# EAGLE schematic PROTOMODULE (EAGLE 6.1)
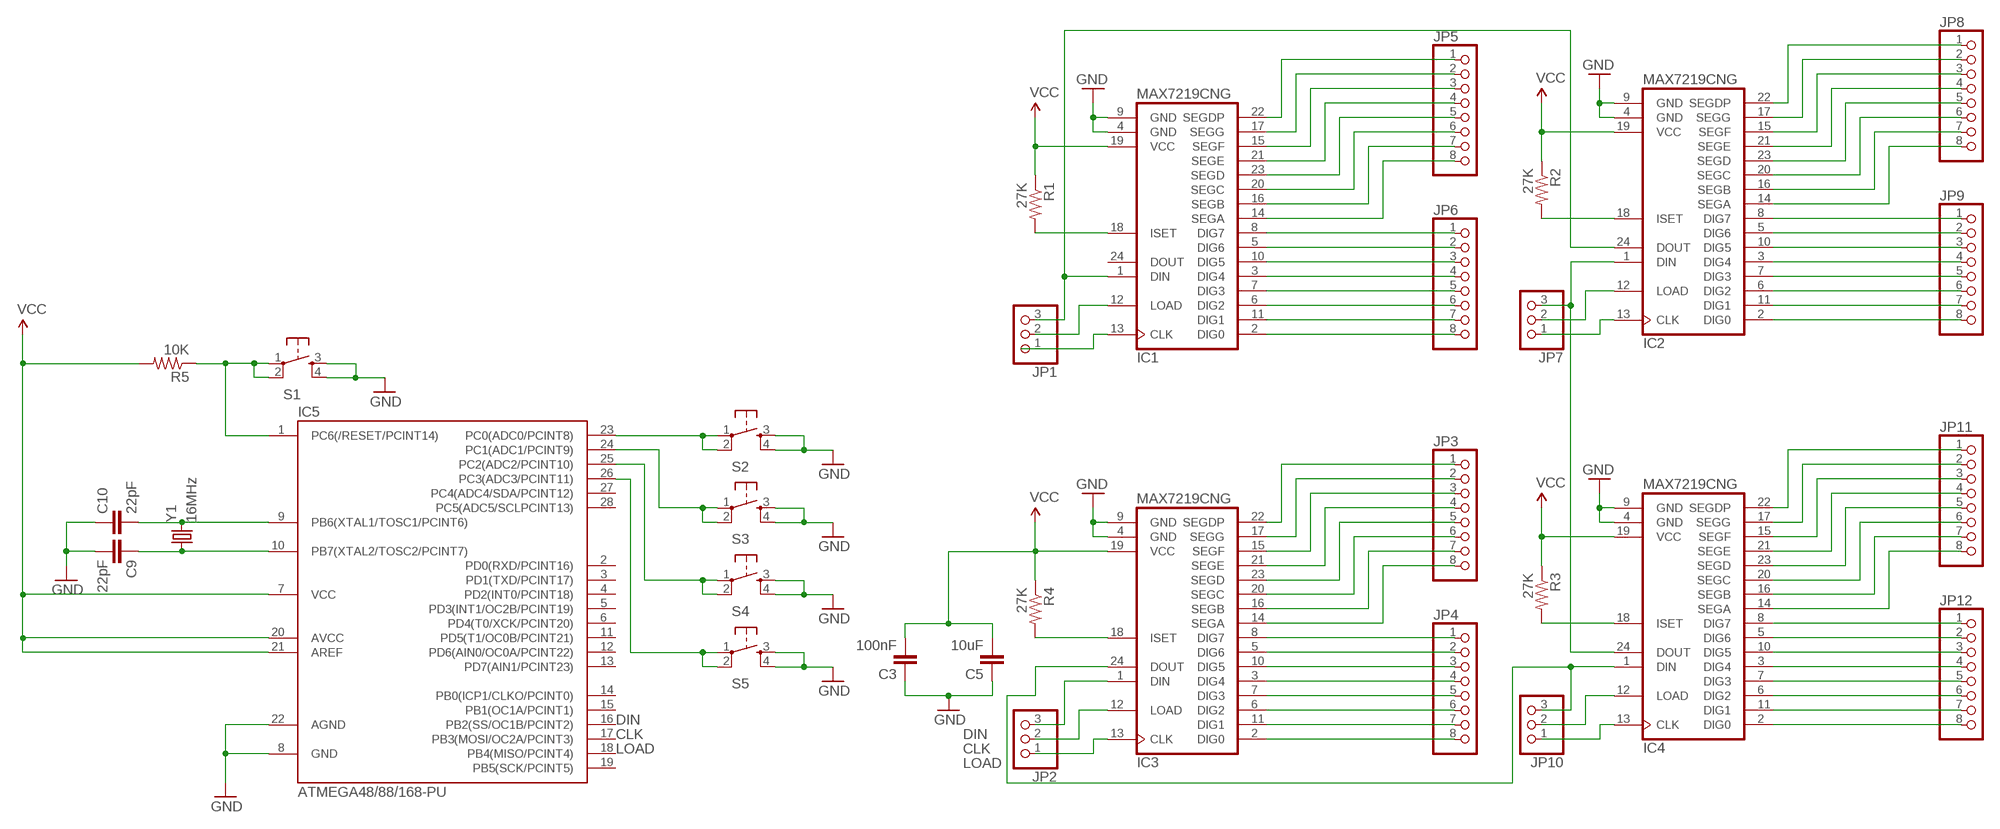
[diagram p0: schematic, sheet 1]

## Parts
C3  100nF  CAPPTH2  [CAP-PTH-SMALL2]
C5  10uF  CAPPTH2  [CAP-PTH-SMALL2]
C9  22pF  CAPPTH2  [CAP-PTH-SMALL2]
C10  22pF  CAPPTH2  [CAP-PTH-SMALL2]
IC1  MAX7219CNG  [DIL24-3]
IC2  MAX7219CNG  [DIL24-3]
IC3  MAX7219CNG  [DIL24-3]
IC4  MAX7219CNG  [DIL24-3]
IC5  ATMEGA48/88/168-PU  [DIL28-3]
JP1  PINHD-1X3CB  [1X03-CLEANBIG]
JP2  PINHD-1X3CB  [1X03-CLEANBIG]
JP3  PINHD-1X8CLEANBIG  [1X08-CLEANBIG]
JP4  PINHD-1X8CLEANBIG  [1X08-CLEANBIG]
JP5  PINHD-1X8CLEANBIG  [1X08-CLEANBIG]
JP6  PINHD-1X8CLEANBIG  [1X08-CLEANBIG]
JP7  PINHD-1X3CB  [1X03-CLEANBIG]
JP8  PINHD-1X8CLEANBIG  [1X08-CLEANBIG]
JP9  PINHD-1X8CLEANBIG  [1X08-CLEANBIG]
JP10  PINHD-1X3CB  [1X03-CLEANBIG]
JP11  PINHD-1X8CLEANBIG  [1X08-CLEANBIG]
JP12  PINHD-1X8CLEANBIG  [1X08-CLEANBIG]
R1  27K  RESISTORPTH-1/2W  [AXIAL-0.5]
R2  27K  RESISTORPTH-1/2W  [AXIAL-0.5]
R3  27K  RESISTORPTH-1/2W  [AXIAL-0.5]
R4  27K  RESISTORPTH-1/2W  [AXIAL-0.5]
R5  10K  RESISTORPTH-1/2W  [AXIAL-0.5]
S1  TAC_SWITCHPTH  [TACTILE-PTH]
S2  TAC_SWITCHPTH  [TACTILE-PTH]
S3  TAC_SWITCHPTH  [TACTILE-PTH]
S4  TAC_SWITCHPTH  [TACTILE-PTH]
S5  TAC_SWITCHPTH  [TACTILE-PTH]
Y1  16MHz  CRYSTALHC49US  [HC49US]

## Nets
GND: C3.1 C5.1 C9.2 C10.1 IC1.4(GND) IC1.9(GND) IC2.4(GND) IC2.9(GND) IC3.4(GND) IC3.9(GND) IC4.4(GND) IC4.9(GND) IC5.8(GND) IC5.22(AGND) S1.3 S1.4 S2.3 S2.4 S3.3 S3.4 S4.3 S4.4 S5.3 S5.4
N$1: IC3.1(DIN) JP2.3
N$2: IC3.12(LOAD) JP2.2
N$3: IC3.13(CLK) JP2.1
N$4: IC3.22(SEGDP) JP3.1
N$5: IC3.17(SEGG) JP3.2
N$6: IC3.15(SEGF) JP3.3
N$7: IC3.21(SEGE) JP3.4
N$8: IC3.23(SEGD) JP3.5
N$9: IC3.20(SEGC) JP3.6
N$10: IC3.16(SEGB) JP3.7
N$11: IC3.14(SEGA) JP3.8
N$12: IC3.8(DIG7) JP4.1
N$13: IC3.5(DIG6) JP4.2
N$14: IC3.10(DIG5) JP4.3
N$15: IC3.3(DIG4) JP4.4
N$16: IC3.7(DIG3) JP4.5
N$17: IC3.6(DIG2) JP4.6
N$18: IC3.11(DIG1) JP4.7
N$19: IC3.2(DIG0) JP4.8
N$20: IC1.18(ISET) R1.P$2
N$21: IC1.1(DIN) IC2.24(DOUT) JP1.3
N$22: IC1.12(LOAD)
N$23: IC3.18(ISET) R4.P$2
N$24: IC1.13(CLK)
N$25: IC1.22(SEGDP) JP5.1
N$26: IC1.17(SEGG) JP5.2
N$27: IC1.15(SEGF) JP5.3
N$28: IC1.21(SEGE) JP5.4
N$29: IC1.23(SEGD) JP5.5
N$30: IC1.20(SEGC) JP5.6
N$31: IC1.16(SEGB) JP5.7
N$32: IC1.14(SEGA) JP5.8
N$33: IC1.8(DIG7) JP6.1
N$34: IC1.5(DIG6) JP6.2
N$35: IC1.10(DIG5) JP6.3
N$36: IC1.3(DIG4) JP6.4
N$37: IC1.7(DIG3) JP6.5
N$38: IC1.6(DIG2) JP6.6
N$39: IC1.11(DIG1) JP6.7
N$40: IC1.2(DIG0) JP6.8
N$41: IC2.18(ISET) R2.P$2
N$42: IC2.1(DIN) IC4.24(DOUT) JP7.3
N$43: IC2.12(LOAD) JP7.2
N$44: IC2.13(CLK) JP7.1
N$45: IC2.22(SEGDP) JP8.1
N$46: IC2.17(SEGG) JP8.2
N$47: IC2.15(SEGF) JP8.3
N$48: IC2.21(SEGE) JP8.4
N$49: IC2.23(SEGD) JP8.5
N$50: IC2.20(SEGC) JP8.6
N$51: IC2.16(SEGB) JP8.7
N$52: IC2.14(SEGA) JP8.8
N$53: IC2.8(DIG7) JP9.1
N$54: IC2.5(DIG6) JP9.2
N$55: IC2.10(DIG5) JP9.3
N$56: IC2.3(DIG4) JP9.4
N$57: IC2.7(DIG3) JP9.5
N$58: IC2.6(DIG2) JP9.6
N$59: IC2.11(DIG1) JP9.7
N$60: IC2.2(DIG0) JP9.8
N$61: IC4.18(ISET) R3.P$2
N$62: IC5.1(PC6(/RESET/PCINT14)) R5.P$1 S1.1 S1.2
N$63: IC4.12(LOAD) JP10.2
N$64: IC4.13(CLK) JP10.1
N$65: IC4.22(SEGDP) JP11.1
N$66: IC4.17(SEGG) JP11.2
N$67: IC4.15(SEGF) JP11.3
N$68: IC4.21(SEGE) JP11.4
N$69: IC4.23(SEGD) JP11.5
N$70: IC4.20(SEGC) JP11.6
N$71: IC4.16(SEGB) JP11.7
N$72: IC4.14(SEGA) JP11.8
N$73: IC4.8(DIG7) JP12.1
N$74: IC4.5(DIG6) JP12.2
N$75: IC4.10(DIG5) JP12.3
N$76: IC4.3(DIG4) JP12.4
N$77: IC4.7(DIG3) JP12.5
N$78: IC4.6(DIG2) JP12.6
N$79: IC4.11(DIG1) JP12.7
N$80: IC4.2(DIG0) JP12.8
N$81: JP1.2
N$82: JP1.1
N$83: IC3.24(DOUT) IC4.1(DIN) JP10.3
N$84: C10.2 IC5.9(PB6(XTAL1/TOSC1/PCINT6)) Y1.2
N$85: C9.1 IC5.10(PB7(XTAL2/TOSC2/PCINT7)) Y1.1
N$86: IC5.23(PC0(ADC0/PCINT8)) S2.1 S2.2
N$87: IC5.24(PC1(ADC1/PCINT9)) S3.1 S3.2
N$88: IC5.25(PC2(ADC2/PCINT10)) S4.1 S4.2
N$89: IC5.26(PC3(ADC3/PCINT11)) S5.1 S5.2
VCC: C3.2 C5.2 IC1.19(VCC) IC2.19(VCC) IC3.19(VCC) IC4.19(VCC) IC5.7(VCC) IC5.20(AVCC) IC5.21(AREF) R1.P$1 R2.P$1 R3.P$1 R4.P$1 R5.P$2
Unconnected: IC1.24(DOUT) IC5.2(PD0(RXD/PCINT16)) IC5.3(PD1(TXD/PCINT17)) IC5.4(PD2(INT0/PCINT18)) IC5.5(PD3(INT1/OC2B/PCINT19)) IC5.6(PD4(T0/XCK/PCINT20)) IC5.11(PD5(T1/OC0B/PCINT21)) IC5.12(PD6(AIN0/OC0A/PCINT22)) IC5.13(PD7(AIN1/PCINT23)) IC5.14(PB0(ICP1/CLKO/PCINT0)) IC5.15(PB1(OC1A/PCINT1)) IC5.16(PB2(SS/OC1B/PCINT2)) IC5.17(PB3(MOSI/OC2A/PCINT3)) IC5.18(PB4(MISO/PCINT4)) IC5.19(PB5(SCK/PCINT5)) IC5.27(PC4(ADC4/SDA/PCINT12)) IC5.28(PC5(ADC5/SCLPCINT13))

## Notes on the sheet
- DIN
- CLK | DIN
- LOAD | CLK
- LOAD

## Library data of the parts
C3 C5 C9 C10 = SparkFun:CAP: Capacitor Standard 0603 ceramic capacitor, and 0.1" leaded capacitor.
IC1-IC4 = maxim:MAX7219CNG: LED DISPLAY DRIVER; MF: MAXIM; MPN: MAX7219CNG; OC_FARNELL: 1523914; OC_NEWARK: 34C4018
IC5 = atmega8:ATMEGA48/88/168-PU
JP1 JP2 JP7 JP10 = adafruit:PINHD-1X3: PIN HEADER
JP3-JP6 JP8 JP9 JP11 JP12 = adafruit:PINHD-1X8: PIN HEADER
R1-R5 = SparkFun:RESISTOR: Resistor Basic schematic elements and footprints for 0603, 1206, and PTH resistors.
S1-S5 = SparkFun:TAC_SWITCH: Momentary Switch Button commonly used for reset or general input. Spark Fun Electronics SKU : COM-00097
Y1 = SparkFun:CRYSTAL: Crystals Various standard crystals. Proven footprints. Spark Fun Electronics SKU : COM-00534